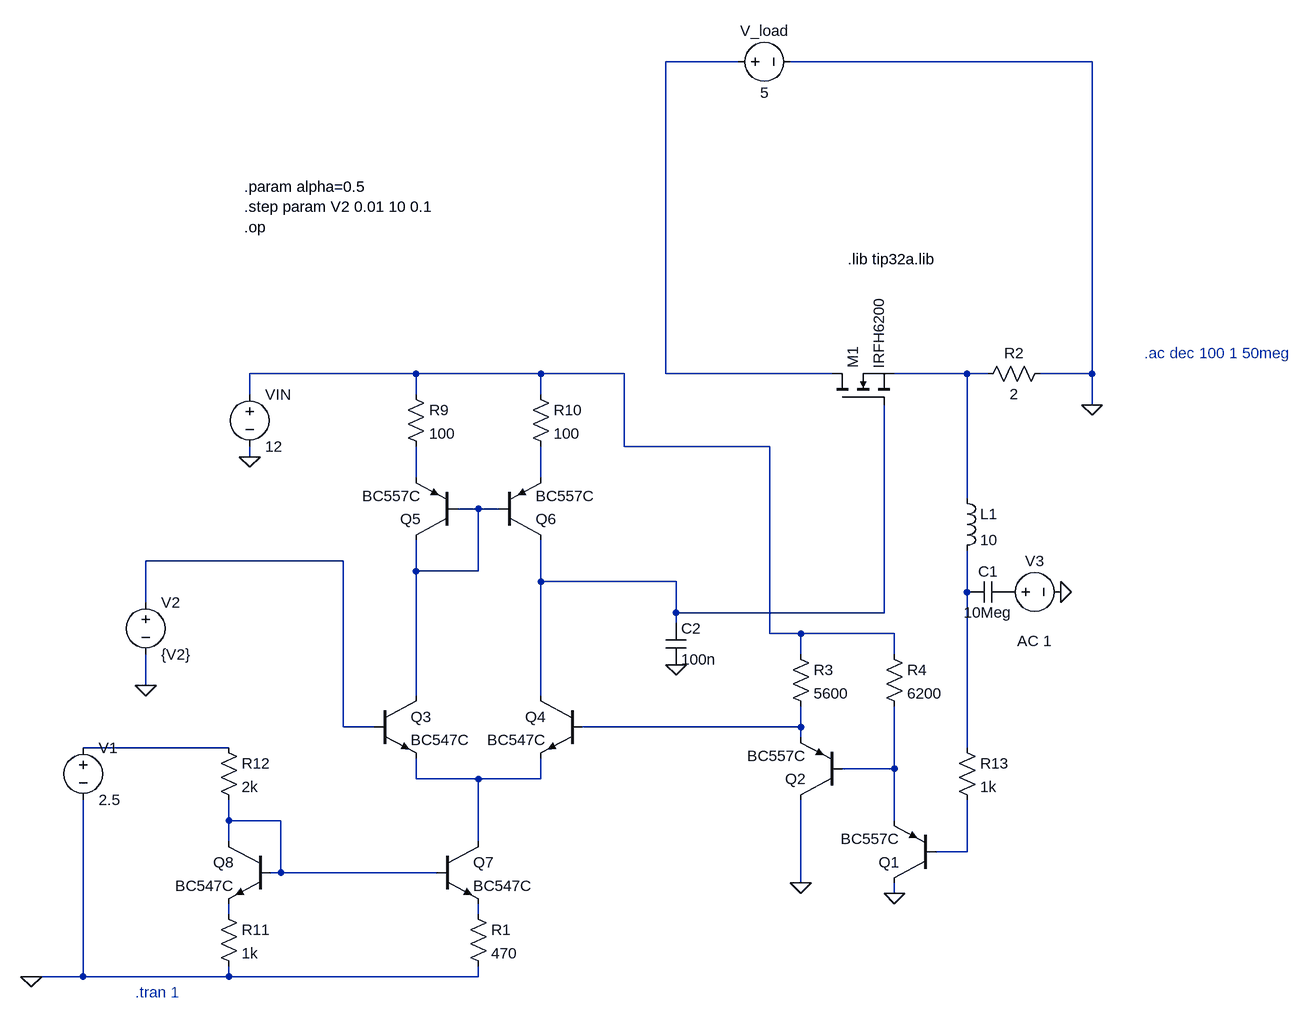
[diagram p0: schematic carga_activa.asc]
carga_activa.asc, the LTspice schematic file:
Version 4
SHEET 1 2888 1972
WIRE 576 -384 464 -384
WIRE 1120 -384 656 -384
WIRE 80 96 -176 96
WIRE 272 96 80 96
WIRE 400 96 272 96
WIRE 464 96 464 -384
WIRE 720 96 464 96
WIRE 928 96 816 96
WIRE 960 96 928 96
WIRE 1120 96 1120 -384
WIRE 1120 96 1040 96
WIRE -176 128 -176 96
WIRE 80 128 80 96
WIRE 272 128 272 96
WIRE 1120 144 1120 96
WIRE 400 208 400 96
WIRE 624 208 400 208
WIRE -176 224 -176 208
WIRE 80 256 80 208
WIRE 272 256 272 208
WIRE 928 288 928 96
WIRE 176 304 144 304
WIRE 208 304 176 304
WIRE -32 384 -336 384
WIRE 80 400 80 352
WIRE 176 400 176 304
WIRE 176 400 80 400
WIRE 272 416 272 352
WIRE 480 416 272 416
WIRE 928 432 928 368
WIRE -336 448 -336 384
WIRE 480 464 480 416
WIRE 800 464 800 144
WIRE 800 464 480 464
WIRE 480 480 480 464
WIRE 624 496 624 208
WIRE 672 496 624 496
WIRE 816 496 672 496
WIRE 672 528 672 496
WIRE 816 528 816 496
WIRE -336 576 -336 528
WIRE 80 592 80 400
WIRE 272 592 272 416
WIRE -32 640 -32 384
WIRE 16 640 -32 640
WIRE 672 640 672 608
WIRE 672 640 336 640
WIRE 672 656 672 640
WIRE -208 672 -432 672
WIRE 928 672 928 432
WIRE 816 704 816 608
WIRE 816 704 736 704
WIRE 80 720 80 688
WIRE 176 720 80 720
WIRE 272 720 272 688
WIRE 272 720 176 720
WIRE -208 784 -208 752
WIRE -128 784 -208 784
WIRE 816 784 816 704
WIRE -208 816 -208 784
WIRE 176 816 176 720
WIRE 928 832 928 752
WIRE 928 832 880 832
WIRE -128 864 -128 784
WIRE -128 864 -144 864
WIRE 112 864 -128 864
WIRE 672 880 672 752
WIRE 816 896 816 880
WIRE -208 928 -208 912
WIRE 176 928 176 912
WIRE -512 1024 -528 1024
WIRE -432 1024 -432 752
WIRE -432 1024 -512 1024
WIRE -208 1024 -208 1008
WIRE -208 1024 -432 1024
WIRE 176 1024 176 1008
WIRE 176 1024 -208 1024
FLAG -176 224 0
FLAG 1120 144 0
FLAG 672 880 0
FLAG 816 896 0
FLAG -336 576 0
FLAG -512 1024 0
FLAG 1072 432 0
FLAG 480 544 0
DATAFLAG 576 96 ""
SYMBOL voltage -176 112 R0
WINDOW 123 0 0 Left 0
WINDOW 39 0 0 Left 0
SYMATTR InstName VIN
SYMATTR Value 12
SYMBOL npn 16 592 R0
SYMATTR InstName Q3
SYMATTR Value BC547C
SYMBOL npn 336 592 M0
SYMATTR InstName Q4
SYMATTR Value BC547C
SYMBOL pnp 144 352 R180
SYMATTR InstName Q5
SYMATTR Value BC557C
SYMBOL pnp 208 352 M180
SYMATTR InstName Q6
SYMATTR Value BC557C
SYMBOL voltage -336 432 R0
WINDOW 123 0 0 Left 0
WINDOW 39 0 0 Left 0
SYMATTR InstName V2
SYMATTR Value {V2}
SYMBOL res 944 112 R270
WINDOW 0 32 56 VTop 2
WINDOW 3 0 56 VBottom 2
SYMATTR InstName R2
SYMATTR Value 2
SYMBOL res 64 112 R0
SYMATTR InstName R9
SYMATTR Value 100
SYMBOL res 256 112 R0
SYMATTR InstName R10
SYMATTR Value 100
SYMBOL npn 112 816 R0
SYMATTR InstName Q7
SYMATTR Value BC547C
SYMBOL res 160 912 R0
SYMATTR InstName R1
SYMATTR Value 470
SYMBOL npn -144 816 M0
SYMATTR InstName Q8
SYMATTR Value BC547C
SYMBOL res -224 912 R0
SYMATTR InstName R11
SYMATTR Value 1k
SYMBOL res -224 656 R0
SYMATTR InstName R12
SYMATTR Value 2k
SYMBOL voltage 560 -384 R270
WINDOW 0 32 56 VTop 2
WINDOW 3 -32 56 VBottom 2
WINDOW 123 0 0 Left 0
WINDOW 39 0 0 Left 0
SYMATTR InstName V_load
SYMATTR Value 5
SYMBOL voltage -432 656 R0
SYMATTR InstName V1
SYMATTR Value 2.5
SYMBOL nmos 720 144 R270
SYMATTR InstName M1
SYMATTR Value IRFH6200
SYMBOL pnp 880 880 R180
SYMATTR InstName Q1
SYMATTR Value BC557C
SYMBOL pnp 736 752 R180
SYMATTR InstName Q2
SYMATTR Value BC557C
SYMBOL res 656 512 R0
SYMATTR InstName R3
SYMATTR Value 5600
SYMBOL res 800 512 R0
SYMATTR InstName R4
SYMATTR Value 6200
SYMBOL res 912 656 R0
SYMATTR InstName R13
SYMATTR Value 1k
SYMBOL ind 912 272 R0
SYMATTR InstName L1
SYMATTR Value 10
SYMBOL cap 992 416 R90
WINDOW 0 0 32 VBottom 2
WINDOW 3 32 32 VTop 2
SYMATTR InstName C1
SYMATTR Value 10Meg
SYMBOL voltage 976 432 R270
WINDOW 0 32 56 VTop 2
WINDOW 3 -32 56 VBottom 2
WINDOW 123 -60 56 VBottom 2
WINDOW 39 0 0 Left 0
SYMATTR InstName V3
SYMATTR Value ""
SYMATTR Value2 AC 1
SYMBOL cap 464 480 R0
SYMATTR InstName C2
SYMATTR Value 100n
TEXT 744 -80 Left 2 !.lib tip32a.lib
TEXT -352 1048 Left 2 ;.tran 1
TEXT -184 -192 Left 2 !.param alpha=0.5\n.step param V2 0.01 10 0.1\n.op
TEXT 1200 64 Left 2 ;.ac dec 100 1 50meg

The netlist it stands for:
* carga_activa.asc
VIN N002 0 12
Q3 N006 N007 N013 0 BC547C
Q4 N008 N010 N013 0 BC547C
Q5 N006 N006 N004 0 BC557C
Q6 N008 N006 N005 0 BC557C
V2 N007 0 {V2}
R2 N003 0 2
R9 N002 N004 100
R10 N002 N005 100
Q7 N013 N014 N017 0 BC547C
R1 N017 0 470
Q8 N014 N014 N016 0 BC547C
R11 N016 0 1k
R12 N011 N014 2k
V_load N001 0 5
V1 N011 0 2.5
M1 N001 N008 N003 N003 IRFH6200
Q1 0 N015 N012 0 BC557C
Q2 0 N012 N010 0 BC557C
R3 N002 N010 5600
R4 N002 N012 6200
R13 N009 N015 1k
L1 N003 N009 10
C1 P001 N009 10Meg
V3 P001 0 AC 1
C2 N008 0 100n
.model NPN NPN
.model PNP PNP
.lib standard.bjt
.model NMOS NMOS
.model PMOS PMOS
.lib standard.mos
.lib tip32a.lib
* .tran 1
.param alpha=0.5
.step param V2 0.01 10 0.1
.op
* .ac dec 100 1 50meg
.backanno
.end